# EasyEDA schematic P04_AUDIO_RGB.json
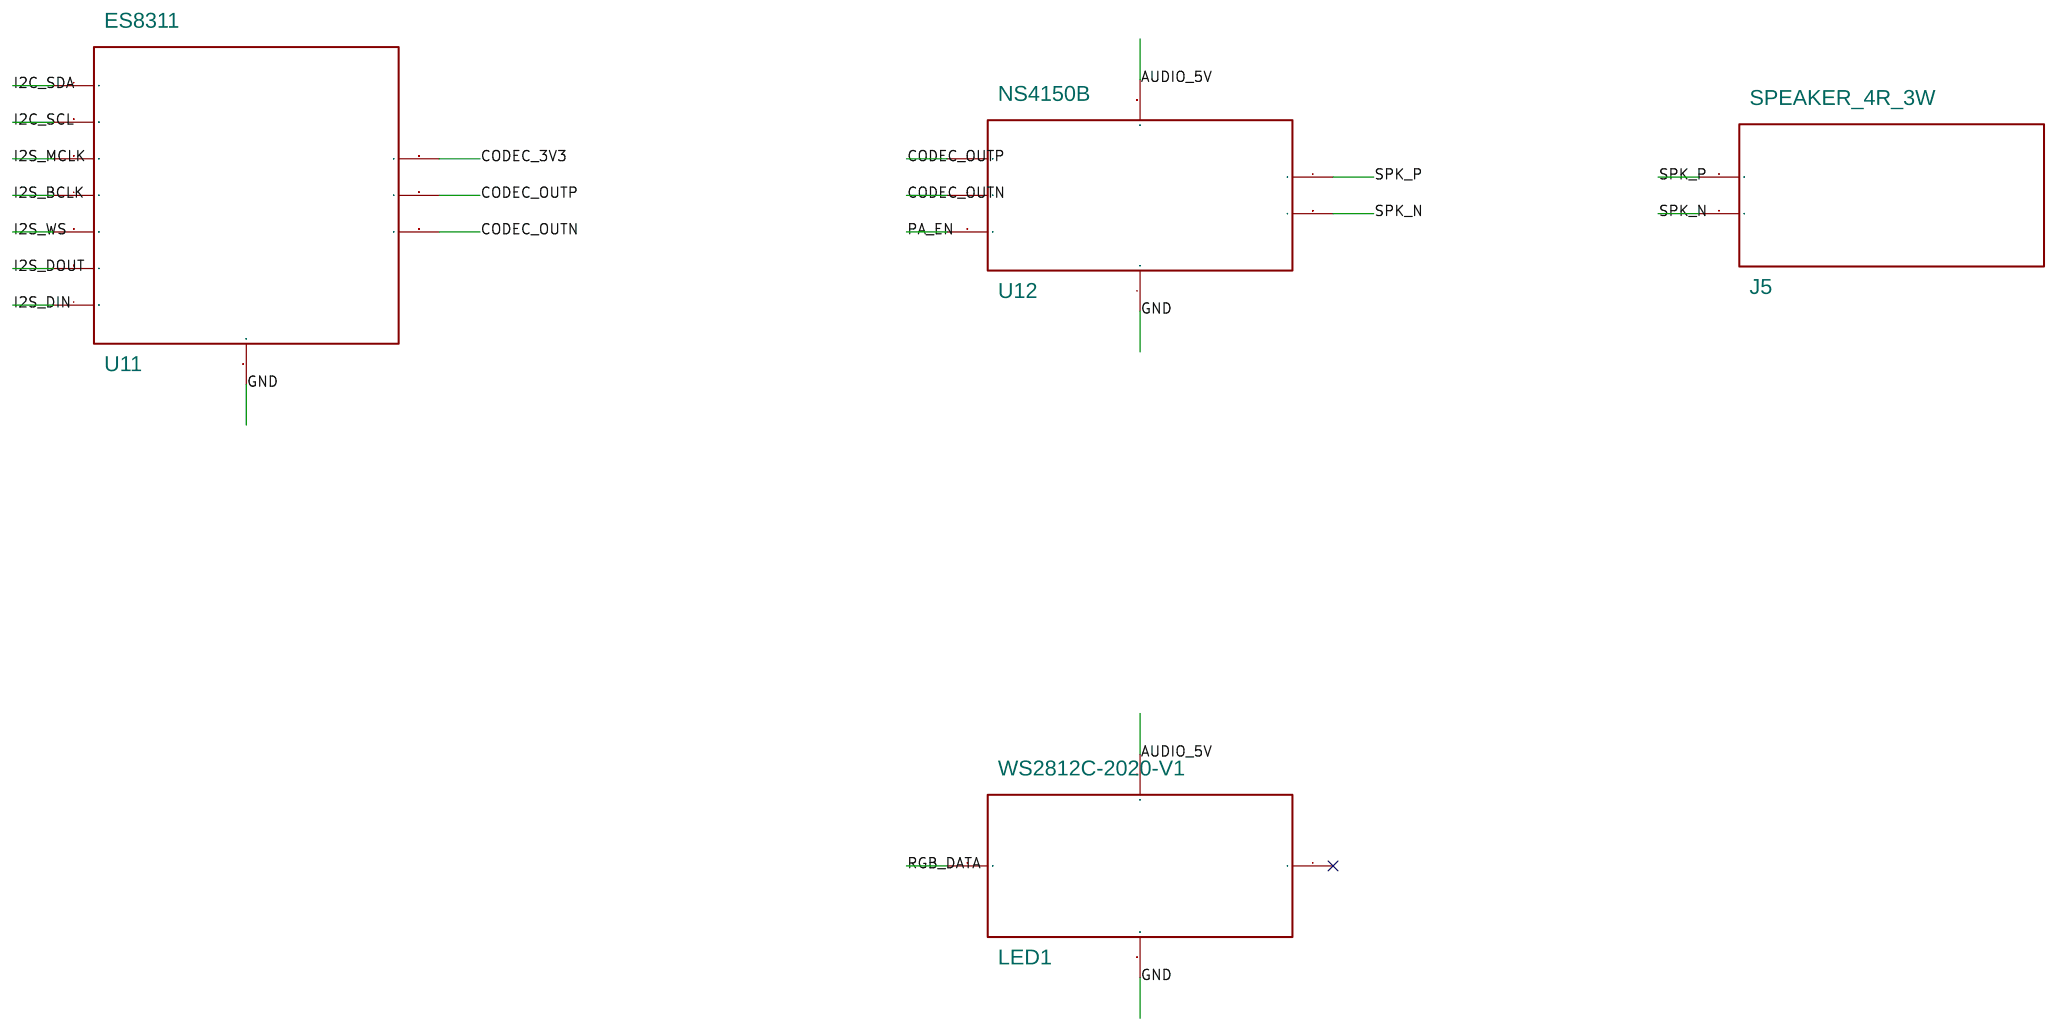
[diagram p0: schematic sheet]

## Parts
J5  SPEAKER_4R_3W  [JST-PH-2P]
LED1  WS2812C-2020-V1  [LED-2020-4P]
U11  ES8311  [QFN-20]
U12  NS4150B  [MSOP-8]

## Library data of the parts
J5 = Speaker
LED1 = WS2812C
U11 = ES8311
U12 = NS4150B

## Nets
GND: LED1.3(1) U11.11(1) U12.7(1)
AUDIO_5V: LED1.2(1) U12.6(1)
CODEC_3V3: U11.8(1)
CODEC_OUTN: U11.10(1) U12.2(1)
CODEC_OUTP: U11.9(1) U12.1
I2C_SCL: U11.2(1)
I2C_SDA: U11.1
I2S_BCLK: U11.4(1)
I2S_DIN: U11.7(1)
I2S_DOUT: U11.6(1)
I2S_MCLK: U11.3(1)
I2S_WS: U11.5(1)
PA_EN: U12.3(1)
RGB_DATA: LED1.1
SPK_N: J5.2(1) U12.5(1)
SPK_P: J5.1 U12.4(1)

Not connected (* = marked no-connect by the designer): LED1 4(1)*

## Notes on the sheet
- P04  ES8311 音频 Codec、NS4150B BTL 功放、扬声器与 WS2812C
- CODEC_3V3 常供，经磁珠/0Ω 与主 3V3 隔离；PA_EN=IO48，默认关闭。
- 扬声器冻结为 4Ω/3W；输出 SPK_P/SPK_N 不接地。LED 首版优先 3.3V 兼容输入。
- ES8311：100nF/1uF 去耦，输出 1uF + 0R
- NS4150B：输入 100nF，VCC 1uF+22uF+22uF
- PA_EN 100kΩ 下拉；BTL 输出不接地
- 音频时序：AUDIO_5V 有效→等待≥30ms→PA_EN→等待约150ms→PCM；充电期间暂停。
